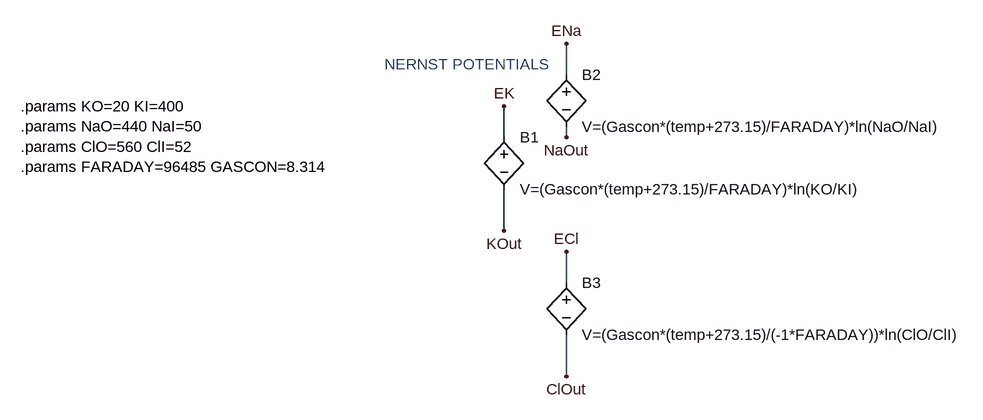
[diagram p0: schematic SquidNernstParameterized.asc]
SquidNernstParameterized.asc, the LTspice schematic file:
Version 4
SHEET 1 2228 680
WIRE 1088 -1120 1088 -1168
WIRE 992 -1024 992 -1072
WIRE 1088 -1024 1088 -1040
WIRE 992 -880 992 -944
WIRE 1088 -800 1088 -848
WIRE 1088 -656 1088 -720
FLAG 992 -1072 EK
FLAG 1088 -1168 ENa
FLAG 1088 -848 ECl
FLAG 992 -880 KOut
FLAG 1088 -1024 NaOut
FLAG 1088 -656 ClOut
SYMBOL bv 992 -1040 R0
SYMATTR InstName B1
SYMATTR Value V=(Gascon*(temp+273.15)/FARADAY)*ln(KO/KI)
SYMBOL bv 1088 -1136 R0
SYMATTR InstName B2
SYMATTR Value V=(Gascon*(temp+273.15)/FARADAY)*ln(NaO/NaI)
SYMBOL bv 1088 -816 R0
SYMATTR InstName B3
SYMATTR Value V=(Gascon*(temp+273.15)/(-1*FARADAY))*ln(ClO/ClI)
TEXT 808 -1136 Left 0 ;NERNST POTENTIALS
TEXT 248 -1072 Left 0 !.params KO=20 KI=400\n.params NaO=440 NaI=50\n.params ClO=560 ClI=52\n.params FARADAY=96485 GASCON=8.314

The netlist it stands for:
* SquidNernstParameterized.asc
B1 EK KOut V=(Gascon*(temp+273.15)/FARADAY)*ln(KO/KI)
B2 ENa NaOut V=(Gascon*(temp+273.15)/FARADAY)*ln(NaO/NaI)
B3 ECl ClOut V=(Gascon*(temp+273.15)/(-1*FARADAY))*ln(ClO/ClI)
* NERNST POTENTIALS
.params KO=20 KI=400
.params NaO=440 NaI=50
.params ClO=560 ClI=52
.params FARADAY=96485 GASCON=8.314
.backanno
.end